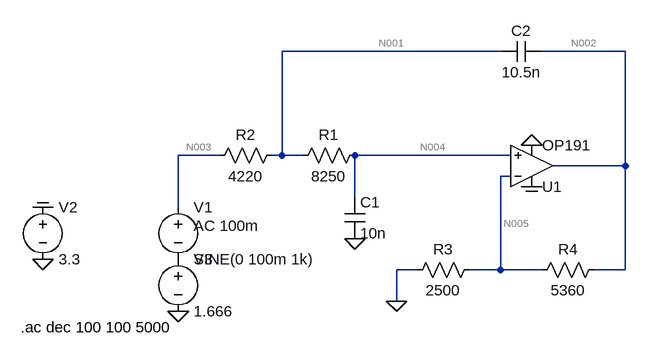
[diagram p0: schematic Draft3.asc]
Draft3.asc, the LTspice schematic file:
Version 4
SHEET 1 880 680
WIRE 160 -1136 -176 -1136
WIRE 352 -1136 224 -1136
WIRE -272 -976 -336 -976
WIRE -176 -976 -176 -1136
WIRE -176 -976 -192 -976
WIRE -144 -976 -176 -976
WIRE 176 -976 -64 -976
WIRE 352 -960 352 -1136
WIRE 352 -960 240 -960
WIRE 176 -944 160 -944
WIRE -64 -912 -64 -976
WIRE -336 -896 -336 -976
WIRE 32 -800 0 -800
WIRE 160 -800 160 -944
WIRE 160 -800 112 -800
WIRE 224 -800 160 -800
WIRE 352 -800 352 -960
WIRE 352 -800 304 -800
WIRE 0 -752 0 -800
FLAG 0 -752 0
FLAG -544 -816 0
FLAG 208 -992 0
FLAG -544 -896 COM
FLAG 208 -928 COM
FLAG -64 -848 0
FLAG -336 -736 0
SYMBOL OpAmps\\OP191 208 -896 M180
SYMATTR InstName U1
SYMBOL cap -80 -912 R0
SYMATTR InstName C1
SYMATTR Value 10n
SYMBOL res -48 -992 R90
WINDOW 0 0 56 VBottom 2
WINDOW 3 32 56 VTop 2
SYMATTR InstName R1
SYMATTR Value 8250
SYMBOL res -288 -960 R270
WINDOW 0 32 56 VTop 2
WINDOW 3 0 56 VBottom 2
SYMATTR InstName R2
SYMATTR Value 4220
SYMBOL res 128 -816 R90
WINDOW 0 0 56 VBottom 2
WINDOW 3 32 56 VTop 2
SYMATTR InstName R3
SYMATTR Value 2500
SYMBOL res 320 -816 R90
WINDOW 0 0 56 VBottom 2
WINDOW 3 32 56 VTop 2
SYMATTR InstName R4
SYMATTR Value 5360
SYMBOL cap 224 -1152 R90
WINDOW 0 0 32 VBottom 2
WINDOW 3 32 32 VTop 2
SYMATTR InstName C2
SYMATTR Value 10.5n
SYMBOL voltage -336 -912 R0
WINDOW 123 24 44 Left 2
WINDOW 39 0 0 Left 0
SYMATTR InstName V1
SYMATTR Value SINE(0 100m 1k)
SYMATTR Value2 AC 100m
SYMBOL voltage -544 -912 R0
WINDOW 123 0 0 Left 0
WINDOW 39 0 0 Left 0
SYMATTR InstName V2
SYMATTR Value 3.3
SYMBOL voltage -336 -832 R0
WINDOW 123 0 0 Left 0
WINDOW 39 0 0 Left 0
SYMATTR InstName V3
SYMATTR Value 1.666
TEXT -578 -712 Left 2 !.ac dec 100 100 5000

The netlist it stands for:
* Draft3.asc
XU1 N004 N005 COM 0 N002 OP191  ; pins In+ In- V+ V- OUT
C1 N004 0 10n
R1 N004 N001 8250
R2 N003 N001 4220
R3 N005 0 2500
R4 N002 N005 5360
C2 N002 N001 10.5n
V1 N003 P001 SINE(0 100m 1k) AC 100m
V2 COM 0 3.3
V3 P001 0 1.666
.ac dec 100 100 5000
.lib ADI.lib
.backanno
.end

* Results of the author's LTspice run, read from the files saved beside the schematic
* Operating Point, zero values left out:
*   V(com) = 3.3 V
*   V(n005) = 1.038 V
*   V(n004) = 1.605 V
*   V(n002) = 3.237 V
*   V(n001) = 1.645 V
*   V(n003) = 1.666 V
*   V(p001) = 1.666 V
*   I(R4) = 410.3 µA
*   I(R3) = 415.2 µA
*   I(R2) = 4.897 µA
*   I(R1) = -4.897 µA
*   I(V3) = -4.897 µA
*   I(V2) = -631.3 µA
*   I(V1) = -4.897 µA
*   Ix(u1:1) = 4.897 µA
*   Ix(u1:2) = -4.957 µA
*   Ix(u1:99) = 631.3 µA
*   Ix(u1:50) = -229.5 µA
*   Ix(u1:45) = -410.3 µA
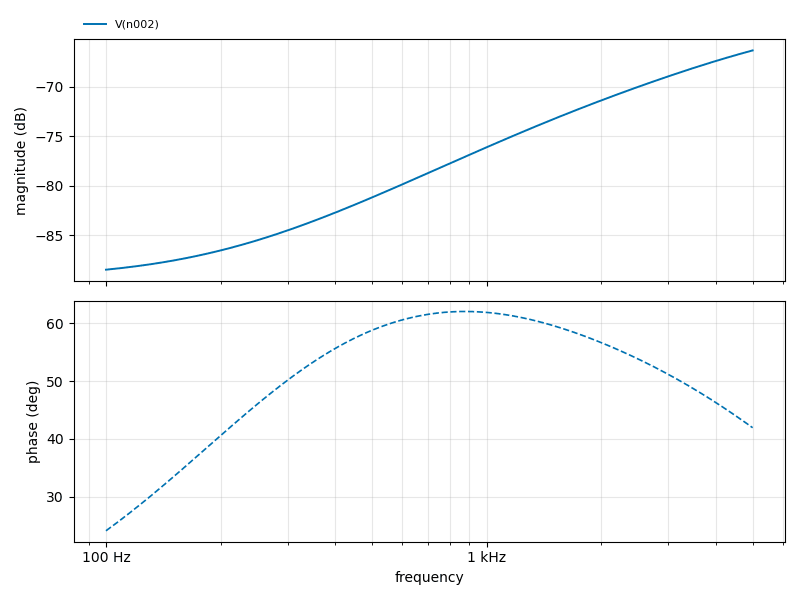
[diagram p1: AC Analysis of Draft3.asc, plotted from the saved traces]
* AC Analysis, 1 run:
*   V(n002): -88.47 dB at 100 Hz, -66.31 dB at 5 kHz, peak -66.31 dB at 5 kHz, 3 dB below the peak at 2.805 kHz